# Altium project python project v2.0.PrjPcb (part 2 of 2)

## Sheet [11]-FPGA_Bank_4_Interface.SchDoc
size A3
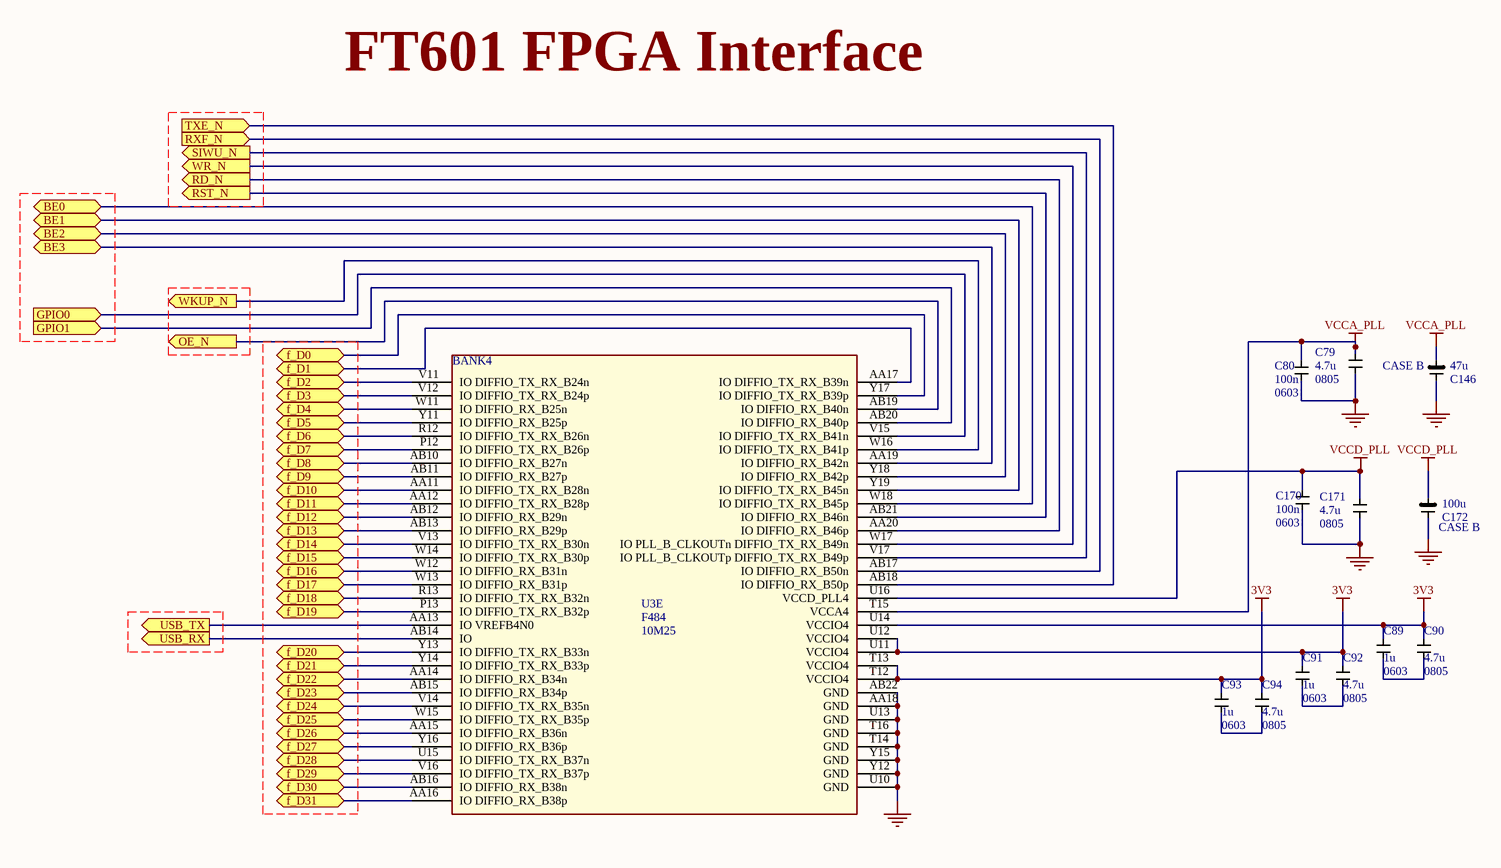
[diagram p10: [11]-FPGA_Bank_4_Interface.SchDoc]

### Parts
C79  4.7u  PCB footprint: 0805
C80  100n  PCB Layer:: 0603  [*0603]
C89  1u  PCB Layer:: 0603  [*0603]
C90  4.7u  PCB Package: 0805  [*CAPC2013X140N]
C91  1u  PCB Layer:: 0603  [*0603]
C92  4.7u  PCB Package: 0805  [*CAPC2013X140N]
C93  1u  PCB Layer:: 0603  [*0603]
C94  4.7u  PCB Package: 0805  [*CAPC2013X140N]
C146  47u  CASE: CASE B  [CAPC3529X21N]
C170  100n  PCB Layer:: 0603  [*0603]
C171  4.7u  PCB footprint: 0805
C172  100u  CASE: CASE B  [CAPC3529X21N]
U3  10M25  Package Type: F484  [*BGA484C100P22X22_2300X2300X200N]  (part E of 9)

### Ports
BE0 (bidir), BE1 (bidir), BE2 (bidir), BE3 (bidir), f_D0 (bidir), f_D1 (bidir), f_D2 (bidir), f_D3 (bidir), f_D4 (bidir), f_D5 (bidir), f_D6 (bidir), f_D7 (bidir), f_D8 (bidir), f_D9 (bidir), f_D10 (bidir), f_D11 (bidir), f_D12 (bidir), f_D13 (bidir), f_D14 (bidir), f_D15 (bidir), f_D16 (bidir), f_D17 (bidir), f_D18 (bidir), f_D19 (bidir), f_D20 (bidir), f_D21 (bidir), f_D22 (bidir), f_D23 (bidir), f_D24 (bidir), f_D25 (bidir), f_D26 (bidir), f_D27 (bidir), f_D28 (bidir), f_D29 (bidir), f_D30 (bidir), f_D31 (bidir), GPIO0 (in), GPIO1 (in), OE_N (out), RD_N (out), RST_N (out), RXF_N (in), SIWU_N (out), TXE_N (in), USB_RX (out), USB_TX (out), WKUP_N (out), WR_N (out)

### Nets
3V3: C89.2 C90.2 C91.2 C92.2 C93.2 C94.2 U3.T12(VCCIO4) U3.T13(VCCIO4) U3.U11(VCCIO4) U3.U12(VCCIO4) U3.U14(VCCIO4)
GND: C79.1 C80.1 C146.2 C170.1 C171.1 C172.2 U3.AA18(GND) U3.AB22(GND) U3.T14(GND) U3.T16(GND) U3.U10(GND) U3.U13(GND) U3.Y12(GND) U3.Y15(GND)
VCCA_PLL: C79.2 C80.2 C146.1 U3.T15(VCCA4)
VCCD_PLL: C170.2 C171.2 C172.1 U3.U16(VCCD_PLL4)
DATA_0: U3.Y17(IO_DIFFIO_TX_RX_B39p) ; port f_D0
DATA_1: U3.AA17(IO_DIFFIO_TX_RX_B39n) ; port f_D1
DATA_2: U3.V11(IO_DIFFIO_TX_RX_B24n) ; port f_D2
DATA_3: U3.V12(IO_DIFFIO_TX_RX_B24p) ; port f_D3
DATA_4: U3.W11(IO_DIFFIO_RX_B25n) ; port f_D4
DATA_5: U3.Y11(IO_DIFFIO_RX_B25p) ; port f_D5
DATA_6: U3.R12(IO_DIFFIO_TX_RX_B26n) ; port f_D6
DATA_7: U3.P12(IO_DIFFIO_TX_RX_B26p) ; port f_D7
DATA_8: U3.AB10(IO_DIFFIO_RX_B27n) ; port f_D8
DATA_9: U3.AB11(IO_DIFFIO_RX_B27p) ; port f_D9
DATA_10: U3.AA11(IO_DIFFIO_TX_RX_B28n) ; port f_D10
DATA_11: U3.AA12(IO_DIFFIO_TX_RX_B28p) ; port f_D11
DATA_12: U3.AB12(IO_DIFFIO_RX_B29n) ; port f_D12
DATA_13: U3.AB13(IO_DIFFIO_RX_B29p) ; port f_D13
DATA_14: U3.V13(IO_DIFFIO_TX_RX_B30n) ; port f_D14
DATA_15: U3.W14(IO_DIFFIO_TX_RX_B30p) ; port f_D15
DATA_16: U3.W12(IO_DIFFIO_RX_B31n) ; port f_D16
DATA_17: U3.W13(IO_DIFFIO_RX_B31p) ; port f_D17
DATA_18: U3.R13(IO_DIFFIO_TX_RX_B32n) ; port f_D18
DATA_19: U3.P13(IO_DIFFIO_TX_RX_B32p) ; port f_D19
DATA_20: U3.Y13(IO_DIFFIO_TX_RX_B33n) ; port f_D20
DATA_21: U3.Y14(IO_DIFFIO_TX_RX_B33p) ; port f_D21
DATA_22: U3.AA14(IO_DIFFIO_RX_B34n) ; port f_D22
DATA_23: U3.AB15(IO_DIFFIO_RX_B34p) ; port f_D23
DATA_24: U3.V14(IO_DIFFIO_TX_RX_B35n) ; port f_D24
DATA_25: U3.W15(IO_DIFFIO_TX_RX_B35p) ; port f_D25
DATA_26: U3.AA15(IO_DIFFIO_RX_B36n) ; port f_D26
DATA_27: U3.Y16(IO_DIFFIO_RX_B36p) ; port f_D27
DATA_28: U3.U15(IO_DIFFIO_TX_RX_B37n) ; port f_D28
DATA_29: U3.V16(IO_DIFFIO_TX_RX_B37p) ; port f_D29
DATA_30: U3.AB16(IO_DIFFIO_RX_B38n) ; port f_D30
DATA_31: U3.AA16(IO_DIFFIO_RX_B38p) ; port f_D31
NetC89_1: C89.1 C90.1
NetC91_1: C91.1 C92.1
NetC93_1: C93.1 C94.1
NetD3_1: U3.AA13(IO_VREFB4N0) ; port USB_TX
NetD4_1: U3.AB14(IO) ; port USB_RX
NetR19_1: U3.AB21(IO_DIFFIO_RX_B46n) ; port RST_N
NetR20_1: U3.W16(IO_DIFFIO_TX_RX_B41p) ; port WKUP_N
NetR21_1: U3.V15(IO_DIFFIO_TX_RX_B41n) ; port GPIO0
NetR22_1: U3.AB20(IO_DIFFIO_RX_B40p) ; port GPIO1
NetR46_1: U3.W18(IO_DIFFIO_TX_RX_B45p) ; port BE0
NetR48_1: U3.Y19(IO_DIFFIO_TX_RX_B45n) ; port BE1
NetR50_1: U3.Y18(IO_DIFFIO_RX_B42p) ; port BE2
NetR52_1: U3.AA19(IO_DIFFIO_RX_B42n) ; port BE3
NetR54_1: U3.AB18(IO_DIFFIO_RX_B50p) ; port TXE_N
NetR56_1: U3.AB17(IO_DIFFIO_RX_B50n) ; port RXF_N
NetR58_1: U3.V17(IO_PLL_B_CLKOUTp_DIFFIO_TX_RX_B49p) ; port SIWU_N
NetR59_1: U3.W17(IO_PLL_B_CLKOUTn_DIFFIO_TX_RX_B49n) ; port WR_N
NetR60_1: U3.AA20(IO_DIFFIO_RX_B46p) ; port RD_N
NetR70_1: U3.AB19(IO_DIFFIO_RX_B40n) ; port OE_N

### Notes on the sheet
- FT601 FPGA Interface
- (in symbol Component_1, part E) BANK4

### Library data of the parts
C79 C80 C89-C94 C146 C170-C172 = Component_1
  C79 C171: Buying URL:: NEED TO BE ADDED
  C80 C89 C91 C93 C170: Buying URL:: https://uk.farnell.com/avx/0603yc105kat2a/cap-1-f-16v-10-x7r-0603/dp/1658870RL?st=1u%200603
  C90 C92 C94: Buying URL:: https://uk.farnell.com/avx/08053d475kat2a/cap-4-7-f-25v-10-x5r-0805/dp/1657932?st=4.7u%200805
  C146 C172: Buying URL:: https://uk.farnell.com/avx/tajb107k006tnj/cap-tant-aec-q200-100uf-6-3v-case/dp/2893386?st=100u%20CASE%20B
U3 = Component_1: Part no.: 10M25DAF484I7G

## Sheet [12]-FPGA_Bank_5_Interface.SchDoc
size A4

## Sheet [13]-FPGA_Bank_6_Interface.SchDoc
size A3
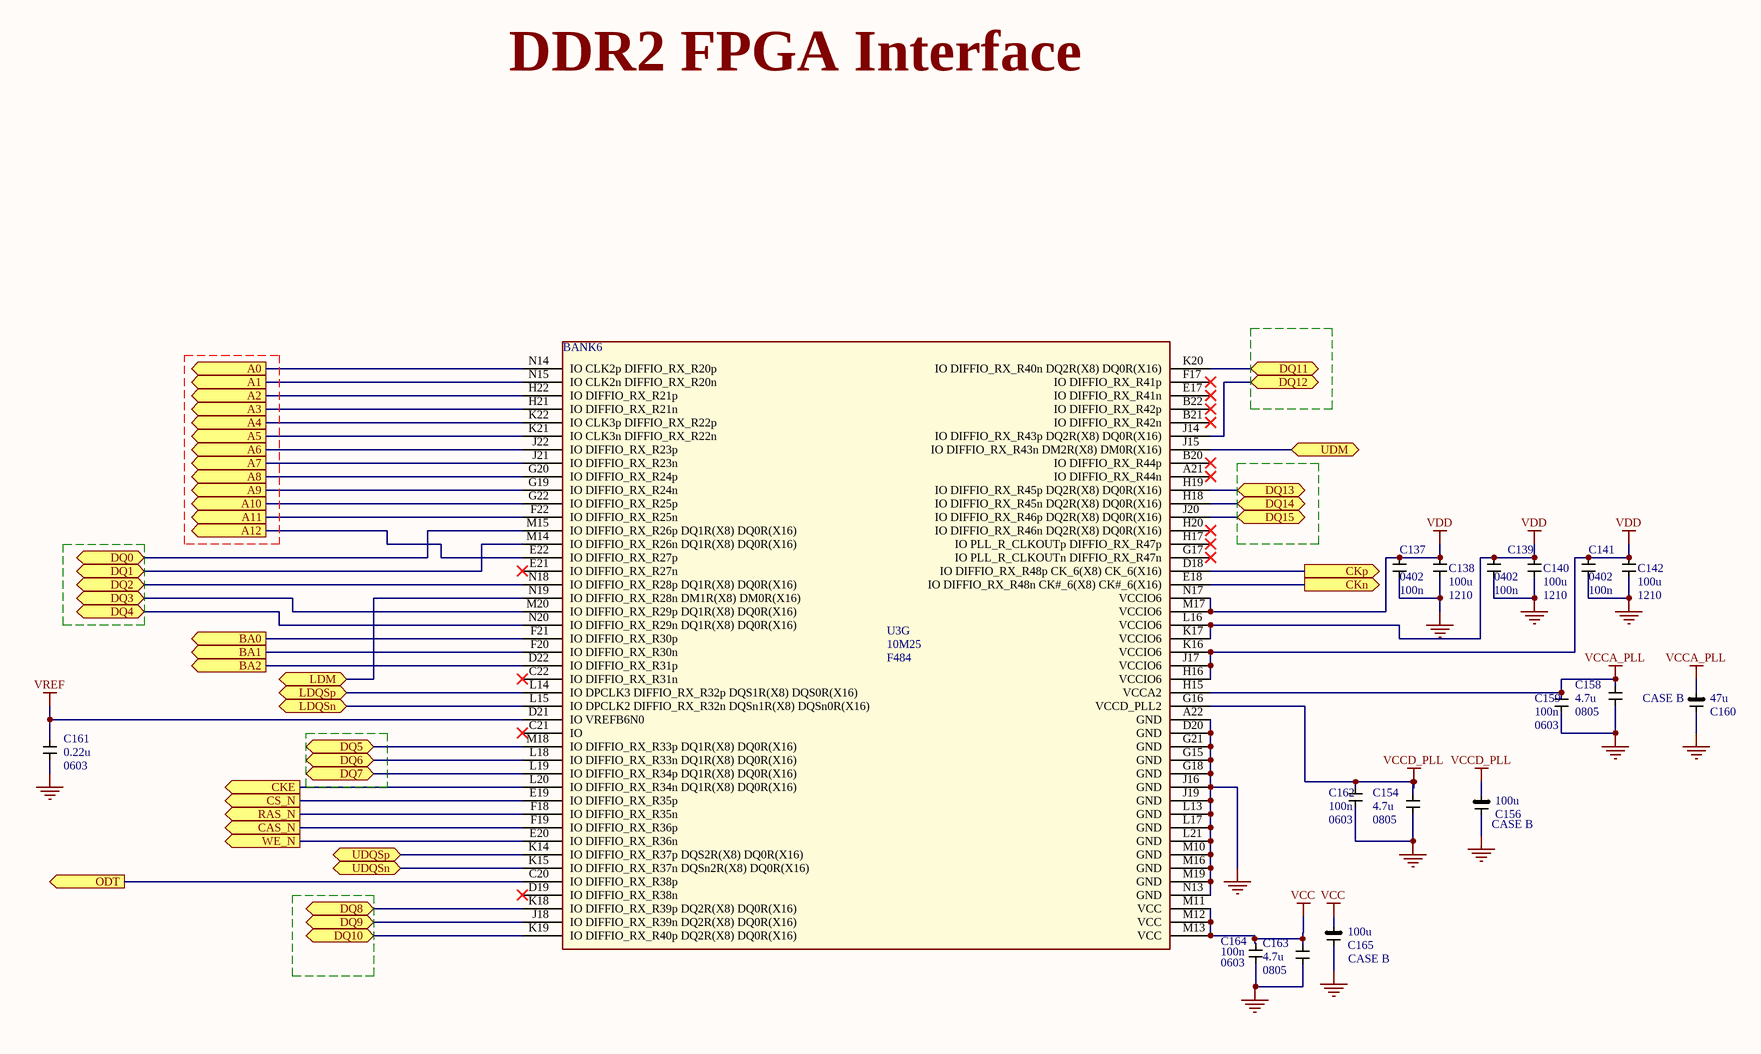
[diagram p11: [13]-FPGA_Bank_6_Interface.SchDoc]

### Parts
C137  100n
C138  100u  PCB package type: 1210  [CAPC3225X28N]
C139  100n
C140  100u  PCB package type: 1210  [CAPC3225X28N]
C141  100n
C142  100u  PCB package type: 1210  [CAPC3225X28N]
C154  4.7u  PCB footprint: 0805
C156  100u  CASE: CASE B  [CAPC3529X21N]
C158  4.7u  PCB footprint: 0805
C159  100n  PCB Layer:: 0603  [*0603]
C160  47u  CASE: CASE B  [CAPC3529X21N]
C161  0.22u  PCB Layer:: 0603  [*0603]
C162  100n  PCB Layer:: 0603  [*0603]
C163  4.7u  PCB footprint: 0805
C164  100n  PCB Layer:: 0603  [*0603]
C165  100u  CASE: CASE B  [CAPC3529X21N]
U3  10M25  Package Type: F484  [*BGA484C100P22X22_2300X2300X200N]  (part G of 9)

### Ports
A0 (out), A1 (out), A2 (out), A3 (out), A4 (out), A5 (out), A6 (out), A7 (out), A8 (out), A9 (out), A10 (out), A11 (out), A12 (out), BA0 (out), BA1 (out), BA2 (out), CAS_N (out), CKE (out), CKn (out), CKp (out), CS_N (out), DQ0, DQ1, DQ2, DQ3, DQ4, DQ5, DQ6, DQ7, DQ8, DQ9, DQ10, DQ11, DQ12, DQ13, DQ14, DQ15, LDM (bidir), LDQSn (bidir), LDQSp (bidir), ODT (out), RAS_N (out), UDM, UDQSn (bidir), UDQSp (bidir), WE_N (out)

### Nets
GND: C137.1 C138.1 C139.1 C140.1 C141.1 C142.1 C154.1 C156.2 C158.1 C159.1 C160.2 C161.1 C162.1 C163.1 C164.1 C165.2 U3.A22(GND) U3.D20(GND) U3.G15(GND) U3.G18(GND) U3.G21(GND) U3.J16(GND) U3.J19(GND) U3.L13(GND) U3.L17(GND) U3.L21(GND) U3.M10(GND) U3.M16(GND) U3.M19(GND) U3.N13(GND)
VCC: C163.2 C164.2 C165.1 U3.M11(VCC) U3.M12(VCC) U3.M13(VCC)
VCCA_PLL: C158.2 C159.2 C160.1 U3.H15(VCCA2)
VCCD_PLL: C154.2 C156.1 C162.2 U3.G16(VCCD_PLL2)
VDD: C137.2 C138.2 C139.2 C140.2 C141.2 C142.2 U3.H16(VCCIO6) U3.J17(VCCIO6) U3.K16(VCCIO6) U3.K17(VCCIO6) U3.L16(VCCIO6) U3.M17(VCCIO6) U3.N17(VCCIO6)
VREF: C161.2 U3.D21(IO_VREFB6N0)
A0: U3.N14(IO_CLK2p_DIFFIO_RX_R20p) ; port A0
A1: U3.N15(IO_CLK2n_DIFFIO_RX_R20n) ; port A1
A2: U3.H22(IO_DIFFIO_RX_R21p) ; port A2
A3: U3.H21(IO_DIFFIO_RX_R21n) ; port A3
A4: U3.K22(IO_CLK3p_DIFFIO_RX_R22p) ; port A4
A5: U3.K21(IO_CLK3n_DIFFIO_RX_R22n) ; port A5
A6: U3.J22(IO_DIFFIO_RX_R23p) ; port A6
A7: U3.J21(IO_DIFFIO_RX_R23n) ; port A7
A8: U3.G20(IO_DIFFIO_RX_R24p) ; port A8
A9: U3.G19(IO_DIFFIO_RX_R24n) ; port A9
A10: U3.G22(IO_DIFFIO_RX_R25p) ; port A10
A11: U3.F22(IO_DIFFIO_RX_R25n) ; port A11
A12: U3.E22(IO_DIFFIO_RX_R27p) ; port A12
BA0: U3.F21(IO_DIFFIO_RX_R30p) ; port BA0
BA1: U3.F20(IO_DIFFIO_RX_R30n) ; port BA1
BA2: U3.D22(IO_DIFFIO_RX_R31p) ; port BA2
CAS_N: U3.F19(IO_DIFFIO_RX_R36p) ; port CAS_N
CK_N: U3.E18(IO_DIFFIO_RX_R48n_CK#_6(X8)_CK#_6(X16)) ; port CKn
CK_P: U3.D18(IO_DIFFIO_RX_R48p_CK_6(X8)_CK_6(X16)) ; port CKp
CKE: U3.L20(IO_DIFFIO_RX_R34n_DQ1R(X8)_DQ0R(X16)) ; port CKE
CS_N: U3.E19(IO_DIFFIO_RX_R35p) ; port CS_N
DQ0: U3.M15(IO_DIFFIO_RX_R26p_DQ1R(X8)_DQ0R(X16)) ; port DQ0
DQ1: U3.M14(IO_DIFFIO_RX_R26n_DQ1R(X8)_DQ0R(X16)) ; port DQ1
DQ2: U3.N18(IO_DIFFIO_RX_R28p_DQ1R(X8)_DQ0R(X16)) ; port DQ2
DQ3: U3.M20(IO_DIFFIO_RX_R29p_DQ1R(X8)_DQ0R(X16)) ; port DQ3
DQ4: U3.N20(IO_DIFFIO_RX_R29n_DQ1R(X8)_DQ0R(X16)) ; port DQ4
DQ5: U3.M18(IO_DIFFIO_RX_R33p_DQ1R(X8)_DQ0R(X16)) ; port DQ5
DQ6: U3.L18(IO_DIFFIO_RX_R33n_DQ1R(X8)_DQ0R(X16)) ; port DQ6
DQ7: U3.L19(IO_DIFFIO_RX_R34p_DQ1R(X8)_DQ0R(X16)) ; port DQ7
DQ8: U3.K18(IO_DIFFIO_RX_R39p_DQ2R(X8)_DQ0R(X16)) ; port DQ8
DQ9: U3.J18(IO_DIFFIO_RX_R39n_DQ2R(X8)_DQ0R(X16)) ; port DQ9
DQ10: U3.K19(IO_DIFFIO_RX_R40p_DQ2R(X8)_DQ0R(X16)) ; port DQ10
DQ11: U3.K20(IO_DIFFIO_RX_R40n_DQ2R(X8)_DQ0R(X16)) ; port DQ11
DQ12: U3.J14(IO_DIFFIO_RX_R43p_DQ2R(X8)_DQ0R(X16)) ; port DQ12
DQ13: U3.H19(IO_DIFFIO_RX_R45p_DQ2R(X8)_DQ0R(X16)) ; port DQ13
DQ14: U3.H18(IO_DIFFIO_RX_R45n_DQ2R(X8)_DQ0R(X16)) ; port DQ14
DQ15: U3.J20(IO_DIFFIO_RX_R46p_DQ2R(X8)_DQ0R(X16)) ; port DQ15
LDM: U3.N19(IO_DIFFIO_RX_R28n_DM1R(X8)_DM0R(X16)) ; port LDM
LDQS_N: U3.L15(IO_DPCLK2_DIFFIO_RX_R32n_DQSn1R(X8)_DQSn0R(X16)) ; port LDQSn
LDQS_P: U3.L14(IO_DPCLK3_DIFFIO_RX_R32p_DQS1R(X8)_DQS0R(X16)) ; port LDQSp
ODT: U3.C20(IO_DIFFIO_RX_R38p) ; port ODT
RAS_N: U3.F18(IO_DIFFIO_RX_R35n) ; port RAS_N
UDM: U3.J15(IO_DIFFIO_RX_R43n_DM2R(X8)_DM0R(X16)) ; port UDM
UDQS_N: U3.K15(IO_DIFFIO_RX_R37n_DQSn2R(X8)_DQ0R(X16)) ; port UDQSn
UDQS_P: U3.K14(IO_DIFFIO_RX_R37p_DQS2R(X8)_DQ0R(X16)) ; port UDQSp
WE_N: U3.E20(IO_DIFFIO_RX_R36n) ; port WE_N

Not connected (* = marked no-connect by the designer): U3 A21(IO_DIFFIO_RX_R44n)* B20(IO_DIFFIO_RX_R44p)* B21(IO_DIFFIO_RX_R42n)* B22(IO_DIFFIO_RX_R42p)* C21(IO)* C22(IO_DIFFIO_RX_R31n)* D19(IO_DIFFIO_RX_R38n)* E17(IO_DIFFIO_RX_R41n)* E21(IO_DIFFIO_RX_R27n)* F17(IO_DIFFIO_RX_R41p)* G17(IO_PLL_R_CLKOUTn_DIFFIO_RX_R47n)* H17(IO_PLL_R_CLKOUTp_DIFFIO_RX_R47p)* H20(IO_DIFFIO_RX_R46n_DQ2R(X8)_DQ0R(X16))*

### Notes on the sheet
- DDR2 FPGA Interface
- (in symbol Component_1) 0402
- (in symbol Component_1, part G) BANK6

### Library data of the parts
C137-C142 C154 C156 C158-C165 = Component_1
  C137 C139 C141: Buying URL: https://uk.farnell.com/avx/04023c104kat2a/cap-0-1-f-25v-10-x7r-0402/dp/1867948?st=100n
  C154 C158 C163: Buying URL:: NEED TO BE ADDED
  C156 C160 C165: Buying URL:: https://uk.farnell.com/avx/tajb107k006tnj/cap-tant-aec-q200-100uf-6-3v-case/dp/2893386?st=100u%20CASE%20B
  C159 C161 C162 C164: Buying URL:: https://uk.farnell.com/avx/0603yc105kat2a/cap-1-f-16v-10-x7r-0603/dp/1658870RL?st=1u%200603
U3 = Component_1: Part no.: 10M25DAF484I7G

## Sheet [14]-FPGA_Bank_7_Interface.SchDoc
size A4
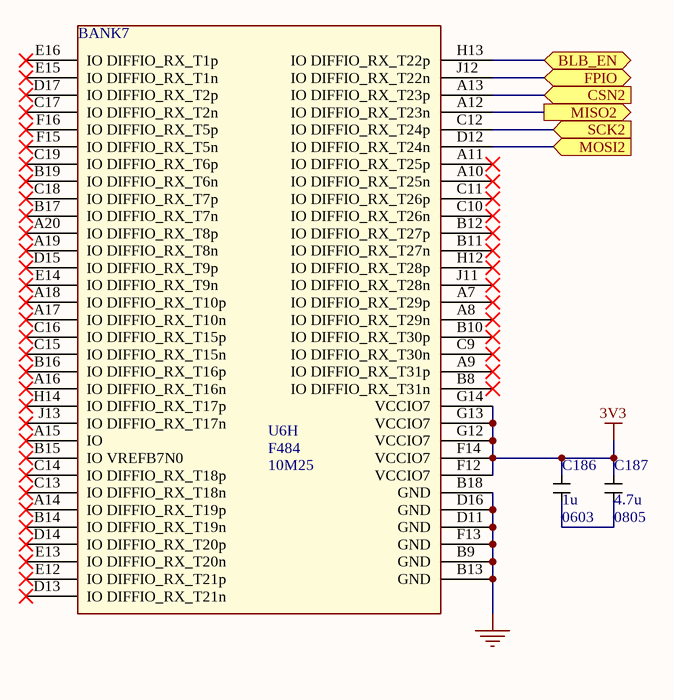
[diagram p12: [14]-FPGA_Bank_7_Interface.SchDoc]

### Parts
C186  1u  PCB Layer:: 0603  [*0603]
C187  4.7u  PCB Package: 0805  [*CAPC2013X140N]
U6  10M25  Package Type: F484  [*BGA484C100P22X22_2300X2300X200N]  (part H of 9)

### Ports
BLB_EN (bidir), CSN2 (in), FPIO (bidir), MISO2 (out), MOSI2 (in), SCK2 (in)

### Nets
3V3: C186.2 C187.2 U6.F12(VCCIO7) U6.F14(VCCIO7) U6.G12(VCCIO7) U6.G13(VCCIO7) U6.G14(VCCIO7)
GND: U6.B9(GND) U6.B13(GND) U6.B18(GND) U6.D11(GND) U6.D16(GND) U6.F13(GND)
NetC186_1: C186.1 C187.1
NetCN2_3: U6.C12(IO_DIFFIO_RX_T24p) ; port SCK2
NetCN2_4: U6.D12(IO_DIFFIO_RX_T24n) ; port MOSI2
NetCN2_5: U6.A12(IO_DIFFIO_RX_T23n) ; port MISO2
NetCN2_6: U6.A13(IO_DIFFIO_RX_T23p) ; port CSN2
NetCN2_7: U6.J12(IO_DIFFIO_RX_T22n) ; port FPIO
NetCN2_8: U6.H13(IO_DIFFIO_RX_T22p) ; port BLB_EN

Not connected (* = marked no-connect by the designer): U6 A7(IO_DIFFIO_RX_T29p)* A8(IO_DIFFIO_RX_T29n)* A9(IO_DIFFIO_RX_T31p)* A10(IO_DIFFIO_RX_T25n)* A11(IO_DIFFIO_RX_T25p)* A14(IO_DIFFIO_RX_T19p)* A15(IO)* A16(IO_DIFFIO_RX_T16n)* A17(IO_DIFFIO_RX_T10n)* A18(IO_DIFFIO_RX_T10p)* A19(IO_DIFFIO_RX_T8n)* A20(IO_DIFFIO_RX_T8p)* B8(IO_DIFFIO_RX_T31n)* B10(IO_DIFFIO_RX_T30p)* B11(IO_DIFFIO_RX_T27n)* B12(IO_DIFFIO_RX_T27p)* B14(IO_DIFFIO_RX_T19n)* B15(IO_VREFB7N0)* B16(IO_DIFFIO_RX_T16p)* B17(IO_DIFFIO_RX_T7n)* B19(IO_DIFFIO_RX_T6n)* C9(IO_DIFFIO_RX_T30n)* C10(IO_DIFFIO_RX_T26n)* C11(IO_DIFFIO_RX_T26p)* C13(IO_DIFFIO_RX_T18n)* C14(IO_DIFFIO_RX_T18p)* C15(IO_DIFFIO_RX_T15n)* C16(IO_DIFFIO_RX_T15p)* C17(IO_DIFFIO_RX_T2n)* C18(IO_DIFFIO_RX_T7p)* C19(IO_DIFFIO_RX_T6p)* D13(IO_DIFFIO_RX_T21n)* D14(IO_DIFFIO_RX_T20p)* D15(IO_DIFFIO_RX_T9p)* D17(IO_DIFFIO_RX_T2p)* E12(IO_DIFFIO_RX_T21p)* E13(IO_DIFFIO_RX_T20n)* E14(IO_DIFFIO_RX_T9n)* E15(IO_DIFFIO_RX_T1n)* E16(IO_DIFFIO_RX_T1p)* F15(IO_DIFFIO_RX_T5n)* F16(IO_DIFFIO_RX_T5p)* H12(IO_DIFFIO_RX_T28p)* H14(IO_DIFFIO_RX_T17p)* J11(IO_DIFFIO_RX_T28n)* J13(IO_DIFFIO_RX_T17n)*

### Notes on the sheet
- (in symbol Component_1, part H) BANK7

### Library data of the parts
C186 C187 = Component_1
  C186: Buying URL:: https://uk.farnell.com/avx/0603yc105kat2a/cap-1-f-16v-10-x7r-0603/dp/1658870RL?st=1u%200603
  C187: Buying URL:: https://uk.farnell.com/avx/08053d475kat2a/cap-4-7-f-25v-10-x5r-0805/dp/1657932?st=4.7u%200805
U6 = Component_1: Part no.: 10M25DAF484I7G

## Sheet [15]-FPGA_Bank_8_Interface.SchDoc
size A4
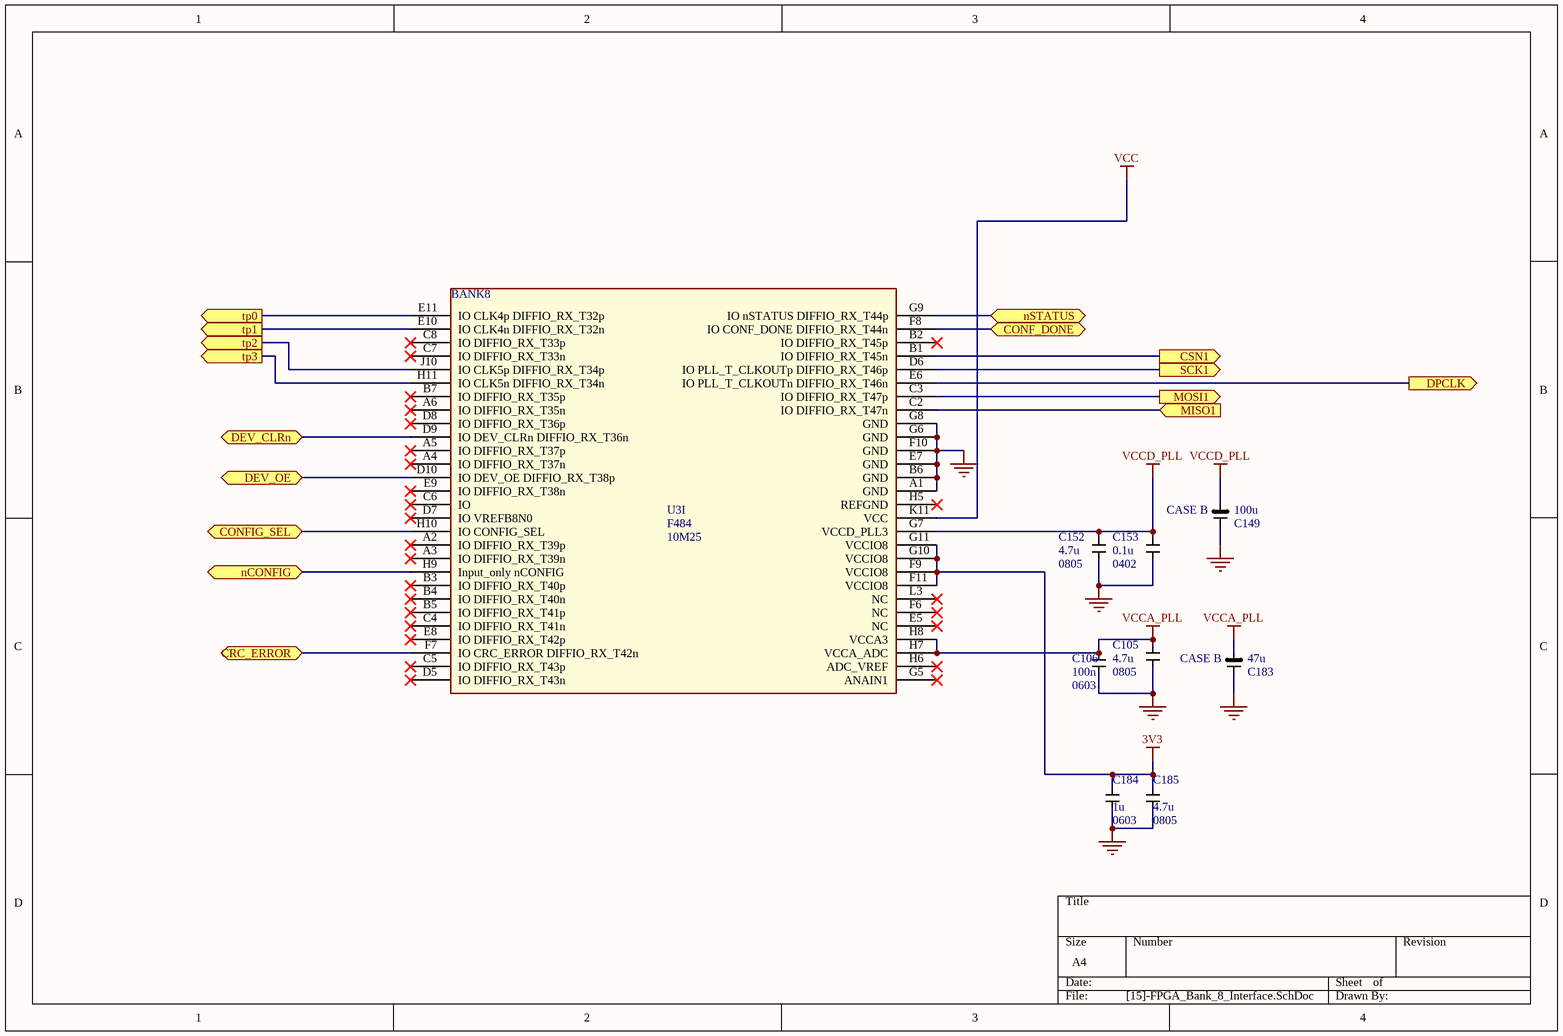
[diagram p13: [15]-FPGA_Bank_8_Interface.SchDoc]

### Parts
C105  4.7u  PCB footprint: 0805
C106  100n  PCB Layer:: 0603  [*0603]
C149  100u  CASE: CASE B  [CAPC3529X21N]
C152  4.7u  PCB footprint: 0805
C153  0.1u  PCB footprint: 0402
C183  47u  CASE: CASE B  [CAPC3529X21N]
C184  1u  PCB Layer:: 0603  [*0603]
C185  4.7u  PCB Package: 0805  [*CAPC2013X140N]
U3  10M25  Package Type: F484  [*BGA484C100P22X22_2300X2300X200N]  (part I of 9)

### Ports
CONF_DONE (bidir), CONFIG_SEL (bidir), CRC_ERROR (bidir), CSN1 (out), DEV_CLRn (bidir), DEV_OE (bidir), DPCLK (out), MISO1 (in), MOSI1 (out), nCONFIG (bidir), nSTATUS (bidir), SCK1 (out), tp0 (out), tp1 (out), tp2 (out), tp3 (out)

### Nets
3V3: C184.2 C185.2 U3.F9(VCCIO8) U3.F11(VCCIO8) U3.G10(VCCIO8) U3.G11(VCCIO8)
GND: C105.1 C106.1 C149.2 C152.1 C153.1 C183.2 C184.1 C185.1 U3.A1(GND) U3.B6(GND) U3.E7(GND) U3.F10(GND) U3.G6(GND) U3.G8(GND)
VCC: U3.K11(VCC)
VCCA_PLL: C105.2 C106.2 C183.1 U3.H7(VCCA_ADC) U3.H8(VCCA3)
VCCD_PLL: C149.1 C152.2 C153.2 U3.G7(VCCD_PLL3)
CONF_DONE: U3.F8(IO_CONF_DONE_DIFFIO_RX_T44n) ; port CONF_DONE
CONFIG_SEL: U3.H10(IO_CONFIG_SEL) ; port CONFIG_SEL
CRC_ERROR: U3.F7(IO_CRC_ERROR_DIFFIO_RX_T42n) ; port CRC_ERROR
DEV_CLRn: U3.D9(IO_DEV_CLRn_DIFFIO_RX_T36n) ; port DEV_CLRn
DEV_OE: U3.D10(IO_DEV_OE_DIFFIO_RX_T38p) ; port DEV_OE
DPCLK: U3.E6(IO_PLL_T_CLKOUTn_DIFFIO_RX_T46n) ; port DPCLK
nCONFIG: U3.H9(Input_only_nCONFIG) ; port nCONFIG
nSTATUS: U3.G9(IO_nSTATUS_DIFFIO_RX_T44p) ; port nSTATUS
NetR87_1: U3.B1(IO_DIFFIO_RX_T45n) ; port CSN1
NetR88_1: U3.C3(IO_DIFFIO_RX_T47p) ; port MOSI1
NetR89_1: U3.C2(IO_DIFFIO_RX_T47n) ; port MISO1
NetTP1_1: U3.E11(IO_CLK4p_DIFFIO_RX_T32p) ; port tp0
NetTP2_1: U3.E10(IO_CLK4n_DIFFIO_RX_T32n) ; port tp1
NetTP3_1: U3.J10(IO_CLK5p_DIFFIO_RX_T34p) ; port tp2
NetTP4_1: U3.H11(IO_CLK5n_DIFFIO_RX_T34n) ; port tp3
NetU3_D6: U3.D6(IO_PLL_T_CLKOUTp_DIFFIO_RX_T46p) ; port SCK1

Not connected (* = marked no-connect by the designer): U3 A2(IO_DIFFIO_RX_T39p)* A3(IO_DIFFIO_RX_T39n)* A4(IO_DIFFIO_RX_T37n)* A5(IO_DIFFIO_RX_T37p)* A6(IO_DIFFIO_RX_T35n)* B2(IO_DIFFIO_RX_T45p)* B3(IO_DIFFIO_RX_T40p)* B4(IO_DIFFIO_RX_T40n)* B5(IO_DIFFIO_RX_T41p)* B7(IO_DIFFIO_RX_T35p)* C4(IO_DIFFIO_RX_T41n)* C5(IO_DIFFIO_RX_T43p)* C6(IO)* C7(IO_DIFFIO_RX_T33n)* C8(IO_DIFFIO_RX_T33p)* D5(IO_DIFFIO_RX_T43n)* D7(IO_VREFB8N0)* D8(IO_DIFFIO_RX_T36p)* E5(NC)* E8(IO_DIFFIO_RX_T42p)* E9(IO_DIFFIO_RX_T38n)* F6(NC)* G5(ANAIN1)* H5(REFGND)* H6(ADC_VREF)* L3(NC)*

### Notes on the sheet
- (in symbol Component_1, part I) BANK8

### Library data of the parts
C105 C106 C149 C152 C153 C183-C185 = Component_1
  C105 C152 C153: Buying URL:: NEED TO BE ADDED
  C106 C184: Buying URL:: https://uk.farnell.com/avx/0603yc105kat2a/cap-1-f-16v-10-x7r-0603/dp/1658870RL?st=1u%200603
  C149 C183: Buying URL:: https://uk.farnell.com/avx/tajb107k006tnj/cap-tant-aec-q200-100uf-6-3v-case/dp/2893386?st=100u%20CASE%20B
  C185: Buying URL:: https://uk.farnell.com/avx/08053d475kat2a/cap-4-7-f-25v-10-x5r-0805/dp/1657932?st=4.7u%200805
U3 = Component_1: Part no.: 10M25DAF484I7G

## Sheet [16]-DDR2_Power_Supply.SchDoc
size A4
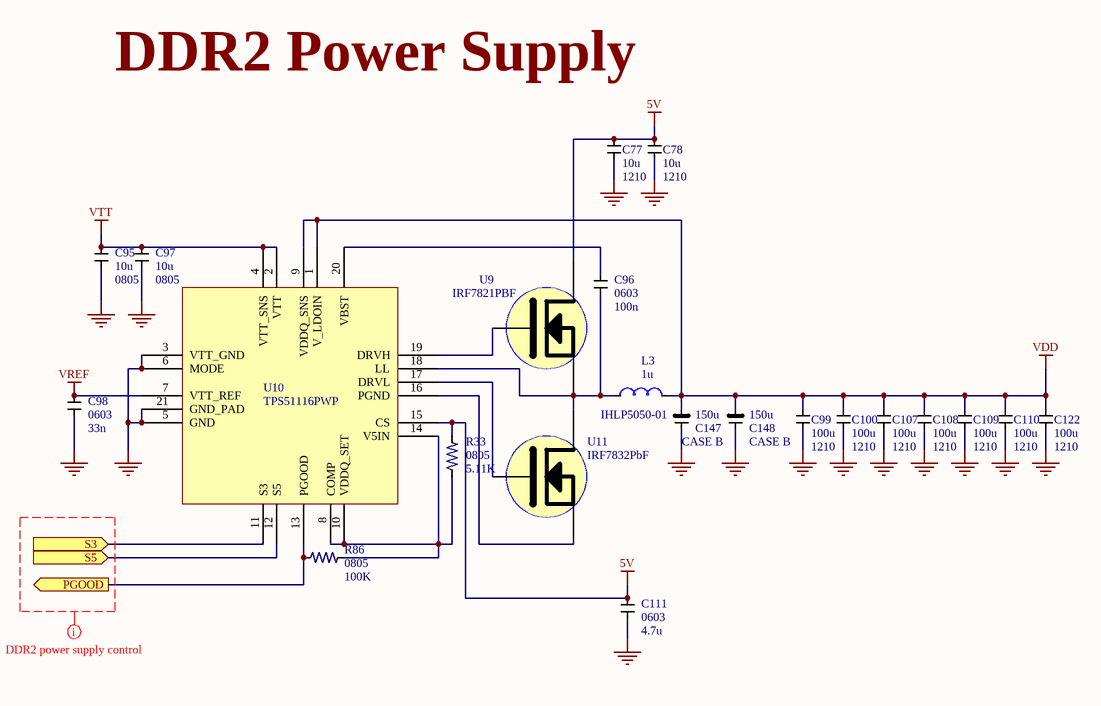
[diagram p14: [16]-DDR2_Power_Supply.SchDoc]

### Parts
C77  10u  PCB package type: 1210  [CAPC3225X28N]
C78  10u  PCB package type: 1210  [CAPC3225X28N]
C95  10u  PCB Package: 0805  [*CAPC2013X140N]
C96  100n  PCB Layer:: 0603  [*0603]
C97  10u  PCB Package: 0805  [*CAPC2013X140N]
C98  33n  PCB Layer:: 0603  [*0603]
C99  100u  PCB package type: 1210  [CAPC3225X28N]
C100  100u  PCB package type: 1210  [CAPC3225X28N]
C107  100u  PCB package type: 1210  [CAPC3225X28N]
C108  100u  PCB package type: 1210  [CAPC3225X28N]
C109  100u  PCB package type: 1210  [CAPC3225X28N]
C110  100u  PCB package type: 1210  [CAPC3225X28N]
C111  4.7u  PCB Layer:: 0603  [*0603]
C122  100u  PCB package type: 1210  [CAPC3225X28N]
C147  150u  CASE: CASE B  [CAPC3529X21N]
C148  150u  CASE: CASE B  [CAPC3529X21N]
L3  1u  [Inductor]
R33  5.11K  PCB footprint: 0805  [*RESC2012X60]
R86  100K  PCB footprint: 0805  [*RESC2012X60]
U9  IRF7821PBF  [SOIC127P600X175-8N]
U10  TPS51116PWP  [SOP65P640X120-21N]
U11  IRF7832PbF  [SOIC127P600X172-8N]

### Ports
PGOOD (out), S3 (in), S5 (in)

### Nets
5V: C77.2 C78.2 C111.2 R33.2 U9.1,2,3(S) U10.15(CS)
GND: C77.1 C78.1 C95.1 C97.1 C98.1 C99.1 C100.1 C107.1 C108.1 C109.1 C110.1 C111.1 C122.1 C147.2 C148.2 U10.3(VTT_GND) U10.5(GND) U10.6(MODE) U10.21(GND_PAD)
VDD: C99.2 C100.2 C107.2 C108.2 C109.2 C110.2 C122.2 C147.1 C148.1 L3.2 U10.1(V_LDOIN) U10.9(VDDQ_SNS)
VREF: C98.2 U10.7(VTT_REF)
VTT: C95.2 C97.2 U10.2(VTT) U10.4(VTT_SNS)
NetC96_1: C96.1 L3.1 U9.8,7,6,5(D) U10.18(LL) U11.1,2,3(S)
NetC96_2: C96.2 U10.20(VBST)
NetR33_1: R33.1 R86.2 U10.8(COMP) U10.10(VDDQ_SET) U10.14(V5IN)
NetR86_1: R86.1 U10.13(PGOOD) ; port PGOOD
NetU3_W9: U10.12(S5) ; port S5
NetU3_W10: U10.11(S3) ; port S3
NetU9_4: U9.4(G) U10.19(DRVH)
NetU10_16: U10.16(PGND) U11.8,7,6,5(D)
NetU10_17: U10.17(DRVL) U11.4(G)

### Layout directives
net class Undefined: (no net found under the mark)

### Notes on the sheet
- DDR2 Power Supply
- (in symbol Component_1) IHLP5050-01

### Library data of the parts
C77 C78 C95-C100 C107-C111 C122 C147 C148 L3 = Component_1
  C95 C97: Buying URL:: https://uk.farnell.com/avx/08053d475kat2a/cap-4-7-f-25v-10-x5r-0805/dp/1657932?st=4.7u%200805
  C96 C98 C111: Buying URL:: https://uk.farnell.com/avx/0603yc105kat2a/cap-1-f-16v-10-x7r-0603/dp/1658870RL?st=1u%200603
  C147 C148: Buying URL:: https://uk.farnell.com/panasonic-electronic-components/4tpe150mazb/cap-150-f-4v-20/dp/2354853?st=4TPC150M#
  L3: Buying URL:: https://www.mouser.co.uk/ProductDetail/Coilcraft/XFL4015-471MEC?qs=zCSbvcPd3pYzCOJSVbeMnw==
R33 R86 = RP73D1J76R8BTDG: Res Thin Film 0603 76.8 Ohm 0.1% 1/10W Â±15ppm/Â°C Molded SMD Paper T/R; Buying URL:: https://uk.farnell.com/yageo/rc0402fr-07100rl/res-100r-1-0-0625w-0402-thick/dp/9239111
U9 = Component_1: MOSFET Transistor, N Channel, 13.6 A, 30 V, 0.0091 ohm, 10 V, 1 V. Used with TPS51116.; Manufacturer: INFINEON; Designer: Faheem; Company: PhasePhotonics; Data Sheet URL: https://www.infineon.com/dgdl/irf7821pbf.pdf?fileId=5546d462533600a401535608d7f31d06; Buyer URL: https://uk.farnell.com/infineon/irf7821pbf/mosfet-n-logic-so-8/dp/1013495?ost=IRF7821PBF&ddkey=https%3Aen-GB%2FElement14_United_Kingdom%2Fsearch; Manufacturer Part No: IRF7821PBF
U10 = TPS51116PWP: DC to DC Controller Single Output Synchronous Buck 3 Volt to 28 Volt Input 20-Pin HTSSOP EP; Manufacturer: Texas Instruments; Designer: Faheem; Company: PhasePhotonics; Data Sheet: http://www.produktinfo.conrad.com/datenblaetter/1000000-1099999/001014812-da-01-en-IC_SYNC_BUCK_C_TPS51116PWPR_TSSOP_20_TID.pdf; SnapEDA_Link: https://www.snapeda.com/parts/TPS51116PWP/Texas%20Instruments/view-part/?ref=snap; Package: HTSSOP-20 Texas Instruments; Part Number: TPS51116PWP; Digi-Key_Purchase_URL: https://www.digikey.co.uk/product-detail/en/texas-instruments/TPS51116PWP/296-17243-ND/675984?utm_source=snapeda&utm_medium=aggregator&utm_campaign=symbol; Digi-Key_Part_Number: 296-17243-ND
U11 = Component_1: IRF7832TRPBF -  MOSFET Transistor, N Channel, 20 A, 30 V, 0.0031 ohm, 10 V, 2.32 V. Used with TPS51116.; Manufacturer: INFINEON; Designer: Faheem; Company: PhasePhotonics; Data Sheet URL: http://www.farnell.com/datasheets/107881.pdf?_ga=2.7827060.752270131.1548443175-886242363.1545409715&_gac=1.221262314.1547824021.Cj0KCQiAj4biBRC-ARIsAA4WaFgEVxY1DDQMjPmwclte-08yP6TbUPRUf-iJ2mTW08_wstvQJToLRRUaArGKEALw_wcB; Buyer URL: https://uk.farnell.com/infineon/irf7832trpbf/mosfet-n-ch-30v-20a-soic-8/dp/2468025?st=IRF7832; Manufacturer Part No: IRF7832TRPBF

## Sheet [17]-FPGA_Power_Supply.SchDoc
size A4
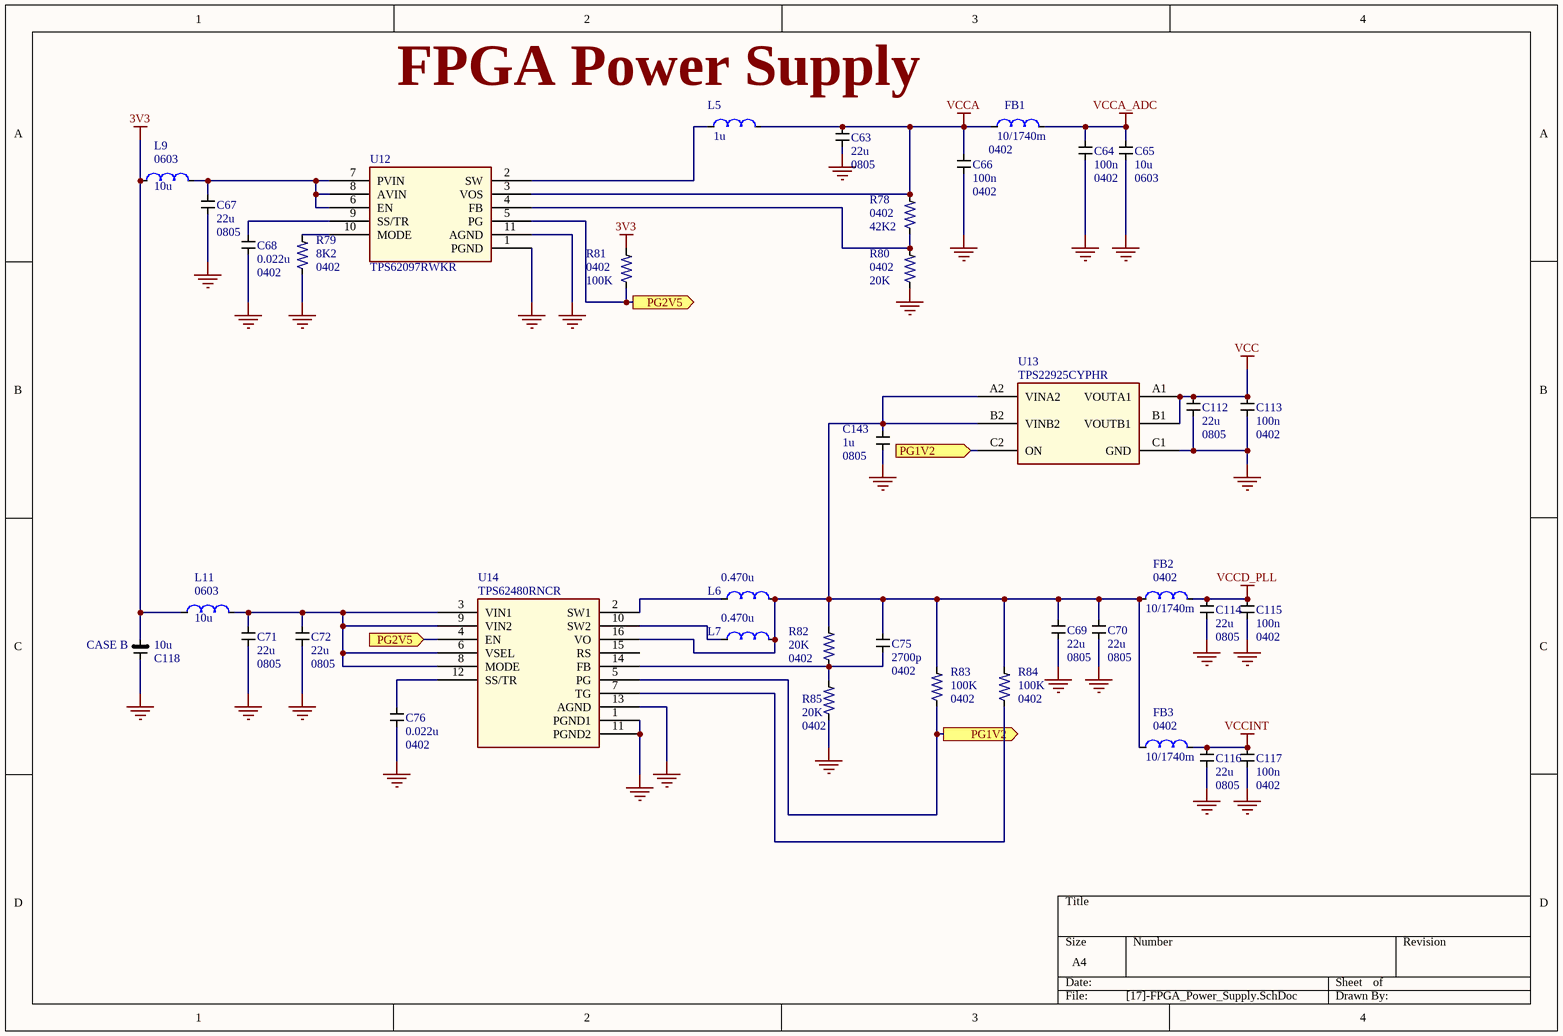
[diagram p15: [17]-FPGA_Power_Supply.SchDoc]

### Parts
C63  22u  PCB Package: 0805  [*CAPC2013X140N]
C64  100n  PCB Stake: 0402  [*CAPC1005X60N]
C65  10u  PCB footprint: 0603
C66  100n  PCB Stake: 0402  [*CAPC1005X60N]
C67  22u  PCB Package: 0805  [*CAPC2013X140N]
C68  0.022u  PCB Stake: 0402  [*CAPC1005X60N]
C69  22u  PCB Package: 0805  [*CAPC2013X140N]
C70  22u  PCB Package: 0805  [*CAPC2013X140N]
C71  22u  PCB Package: 0805  [*CAPC2013X140N]
C72  22u  PCB Package: 0805  [*CAPC2013X140N]
C75  2700p  PCB Stake: 0402  [*CAPC1005X60N]
C76  0.022u  PCB Stake: 0402  [*CAPC1005X60N]
C112  22u  PCB Package: 0805  [*CAPC2013X140N]
C113  100n  PCB Stake: 0402  [*CAPC1005X60N]
C114  22u  PCB Package: 0805  [*CAPC2013X140N]
C115  100n  PCB Stake: 0402  [*CAPC1005X60N]
C116  22u  PCB Package: 0805  [*CAPC2013X140N]
C117  100n  PCB Stake: 0402  [*CAPC1005X60N]
C118  10u  CASE: CASE B  [CAPC3529X21N]
C143  1u  PCB footprint: 0805
FB1  10/1740m  Package Type: 0402  [*CAPC1005X55N]
FB2  10/1740m  Package Type: 0402  [*CAPC1005X55N]
FB3  10/1740m  Package Type: 0402  [*CAPC1005X55N]
L5  1u  [*INDM4040X210]
L6  0.470u  [INDC3234X16N]
L7  0.470u  [INDC3234X16N]
L9  10u  PCB Layout:: 0603  [*INDC1608X95N]
L11  10u  PCB Layout:: 0603  [*INDC1608X95N]
R78  42K2  PCB footprint: 0402  [*R0402]
R79  8K2  PCB footprint: 0402  [*R0402]
R80  20K  PCB footprint: 0402  [*R0402]
R81  100K  PCB footprint: 0402  [*R0402]
R82  20K  PCB footprint: 0402  [*R0402]
R83  100K  PCB footprint: 0402  [*R0402]
R84  100K  PCB footprint: 0402  [*R0402]
R85  20K  PCB footprint: 0402  [*R0402]
U12  TPS62097RWKR  [PCBComponent_1 - duplicate1]
U13  TPS22925CYPHR  [BGA]
U14  TPS62480RNCR  [PCBComponent_1]

### Ports
PG1V2 (in), PG1V2 (out), PG2V5 (in), PG2V5 (out)

### Nets
3V3: C118.1 L9.1 L11.1 R81.2
GND: C63.1 C64.1 C65.1 C66.1 C67.1 C68.1 C69.1 C70.1 C71.1 C72.1 C76.1 C112.1 C113.1 C114.1 C115.1 C116.1 C117.1 C118.2 C143.1 R79.1 R80.1 R85.1 U12.1(PGND) U12.11(AGND) U13.C1(GND) U14.1(PGND1) U14.11(PGND2) U14.13(AGND)
VCC: C112.2 C113.2 U13.A1(VOUTA1) U13.B1(VOUTB1)
VCCA: C63.2 C66.2 FB1.1 L5.2 R78.2 U12.3(VOS)
VCCA_ADC: C64.2 C65.2 FB1.2
VCCD_PLL: C114.2 C115.2 FB2.2
VCCINT: C116.2 C117.2 FB3.2
NetC67_2: C67.2 L9.2 U12.6(EN) U12.7(PVIN) U12.8(AVIN)
NetC68_2: C68.2 U12.9(SS/TR)
NetC69_2: C69.2 C70.2 C75.2 C143.2 FB2.1 FB3.1 L6.2 L7.2 R82.2 R83.2 R84.2 U13.A2(VINA2) U13.B2(VINB2) U14.16(VO)
NetC71_2: C71.2 C72.2 L11.2 U14.3(VIN1) U14.6(VSEL) U14.8(MODE) U14.9(VIN2)
NetC75_1: C75.1 R82.1 R85.2 U14.14(FB)
NetC76_2: C76.2 U14.12(SS/TR)
NetL5_1: L5.1 U12.2(SW)
NetL6_1: L6.1 U14.2(SW1)
NetL7_1: L7.1 U14.10(SW2)
NetR78_1: R78.1 R80.2 U12.4(FB)
NetR79_2: R79.2 U12.10(MODE)
NetR81_1: R81.1 U12.5(PG) U14.4(EN) ; port PG2V5
NetR83_1: R83.1 U13.C2(ON) U14.5(PG) ; port PG1V2
NetR84_1: R84.1 U14.7(TG)

Not connected (* = marked no-connect by the designer): U14 15(RS)

### Notes on the sheet
- FPGA Power Supply

### Library data of the parts
C63-C72 C75 C76 C112-C118 C143 FB1-FB3 L5-L7 L9 L11 U12-U14 = Component_1
  C63 C67 C69-C72 C112 C114 C116: Buying URL:: https://uk.farnell.com/avx/08053d475kat2a/cap-4-7-f-25v-10-x5r-0805/dp/1657932?st=4.7u%200805
  C64 C66 C68 C75 C76 C113 C115 C117: Buying URL:: https://uk.farnell.com/avx/04023c104kat2a/cap-0-1-f-25v-10-x7r-0402/dp/1867948RL
  C65: Buying URL:: https://uk.farnell.com/avx/06031c104kat2a/cap-0-1-f-100v-10-x7r-0603/dp/2749806?st=100nf
  C118: Buying URL:: https://uk.farnell.com/avx/tajb107k006tnj/cap-tant-aec-q200-100uf-6-3v-case/dp/2893386?st=100u%20CASE%20B
  C143: Buying URL:: NEED TO BE ADDED
  FB1-FB3: Buying URL:: https://uk.farnell.com/murata/blm15ax100sn1d/ferrite-bead-0402-0-015ohm-1-74a/dp/2443220?st=BLM15AX100SN1D
  L5: Buying  URL: https://uk.farnell.com/coilcraft/xfl4020-102mec/inductor-1uh-11a-20-pwr-64mhz/dp/2289214?st=XFL4020-102ME; Package Type: 4x2x4mm
  L6 L7: Buying URL:: https://www.mouser.co.uk/ProductDetail/Coilcraft/XFL4015-471MEC?qs=zCSbvcPd3pYzCOJSVbeMnw==
  L9 L11: Buying URL:: https://uk.farnell.com/tdk/mlz1608m100wt/inductor-10uh-20-shielded/dp/2215635?st=10uH%200603
R78-R85 = RP73D1J76R8BTDG: as R33 on sheet [16]-DDR2_Power_Supply; Buying URL:: https://uk.farnell.com/yageo/rc0402fr-07100rl/res-100r-1-0-0625w-0402-thick/dp/9239111

## Nets that join several sheets
3V3: [03]-Python_Camera_Interface (8 pins), [04]-FT601_USB_Tx_Rx_Interface (18 pins), [05]-USB_C_MUX_Interface (5 pins), [07]-SDcard_Testpoints_Ext_SPI_Interface (6 pins), [08]-FPGA_Bank_1_Interface (8 pins), [10]-FPGA_Bank_3_Interface (10 pins), [11]-FPGA_Bank_4_Interface (11 pins), [14]-FPGA_Bank_7_Interface (7 pins), [15]-FPGA_Bank_8_Interface (6 pins), [17]-FPGA_Power_Supply (C118.1 L9.1 L11.1 R81.2)
5V: [04]-FT601_USB_Tx_Rx_Interface (C41.1 C44.2 VR1.3), [05]-USB_C_MUX_Interface (C81.1 L4.1), [07]-SDcard_Testpoints_Ext_SPI_Interface (C150.1 L10.2), [16]-DDR2_Power_Supply (6 pins)
GND: [03]-Python_Camera_Interface (50 pins), [04]-FT601_USB_Tx_Rx_Interface (39 pins), [05]-USB_C_MUX_Interface (30 pins), [06]-DDR2_Interface (25 pins), [07]-SDcard_Testpoints_Ext_SPI_Interface (7 pins), [08]-FPGA_Bank_1_Interface (30 pins), [10]-FPGA_Bank_3_Interface (9 pins), [11]-FPGA_Bank_4_Interface (14 pins), [13]-FPGA_Bank_6_Interface (30 pins), [14]-FPGA_Bank_7_Interface (6 pins), [15]-FPGA_Bank_8_Interface (14 pins), [16]-DDR2_Power_Supply (19 pins), [17]-FPGA_Power_Supply (28 pins)
VBUS: [04]-FT601_USB_Tx_Rx_Interface (R23.2), [05]-USB_C_MUX_Interface (7 pins)
VCC: [08]-FPGA_Bank_1_Interface (10 pins), [13]-FPGA_Bank_6_Interface (6 pins), [15]-FPGA_Bank_8_Interface (U3.K11), [17]-FPGA_Power_Supply (C112.2 C113.2 U13.A1 U13.B1)
VCCA_PLL: [11]-FPGA_Bank_4_Interface (C79.2 C80.2 C146.1 U3.T15), [13]-FPGA_Bank_6_Interface (C158.2 C159.2 C160.1 U3.H15), [15]-FPGA_Bank_8_Interface (5 pins)
VCCD_PLL: [08]-FPGA_Bank_1_Interface (C173.2 C174.2 C175.1 U3.J7), [11]-FPGA_Bank_4_Interface (C170.2 C171.2 C172.1 U3.U16), [13]-FPGA_Bank_6_Interface (C154.2 C156.1 C162.2 U3.G16), [15]-FPGA_Bank_8_Interface (C149.1 C152.2 C153.2 U3.G7), [17]-FPGA_Power_Supply (C114.2 C115.2 FB2.2)
VDD: [06]-DDR2_Interface (24 pins), [08]-FPGA_Bank_1_Interface (7 pins), [13]-FPGA_Bank_6_Interface (13 pins), [16]-DDR2_Power_Supply (12 pins)
VREF: [06]-DDR2_Interface (C135.2 U5.J2), [08]-FPGA_Bank_1_Interface (C145.2 U3.P22), [13]-FPGA_Bank_6_Interface (C161.2 U3.D21), [16]-DDR2_Power_Supply (C98.2 U10.7)
VTT: [08]-FPGA_Bank_1_Interface (C136.2 C144.2 R26.2), [16]-DDR2_Power_Supply (C95.2 C97.2 U10.2 U10.4)
A0: [06]-DDR2_Interface (U5.M8), [13]-FPGA_Bank_6_Interface (U3.N14)
A1: [06]-DDR2_Interface (U5.M3), [13]-FPGA_Bank_6_Interface (U3.N15)
A2: [06]-DDR2_Interface (U5.M7), [13]-FPGA_Bank_6_Interface (U3.H22)
A3: [06]-DDR2_Interface (U5.N2), [13]-FPGA_Bank_6_Interface (U3.H21)
A4: [06]-DDR2_Interface (U5.N8), [13]-FPGA_Bank_6_Interface (U3.K22)
A5: [06]-DDR2_Interface (U5.N3), [13]-FPGA_Bank_6_Interface (U3.K21)
A6: [06]-DDR2_Interface (U5.N7), [13]-FPGA_Bank_6_Interface (U3.J22)
A7: [06]-DDR2_Interface (U5.P2), [13]-FPGA_Bank_6_Interface (U3.J21)
A8: [06]-DDR2_Interface (U5.P8), [13]-FPGA_Bank_6_Interface (U3.G20)
A9: [06]-DDR2_Interface (U5.P3), [13]-FPGA_Bank_6_Interface (U3.G19)
A10: [06]-DDR2_Interface (U5.M2), [13]-FPGA_Bank_6_Interface (U3.G22)
A11: [06]-DDR2_Interface (U5.P7), [13]-FPGA_Bank_6_Interface (U3.F22)
A12: [06]-DDR2_Interface (U5.R2), [13]-FPGA_Bank_6_Interface (U3.E22)
BA0: [06]-DDR2_Interface (U5.L2), [13]-FPGA_Bank_6_Interface (U3.F21)
BA1: [06]-DDR2_Interface (U5.L3), [13]-FPGA_Bank_6_Interface (U3.F20)
BA2: [06]-DDR2_Interface (U5.L1), [13]-FPGA_Bank_6_Interface (U3.D22)
CAS_N: [06]-DDR2_Interface (U5.L7), [13]-FPGA_Bank_6_Interface (U3.F19)
CK_N: [06]-DDR2_Interface (U5.K8), [13]-FPGA_Bank_6_Interface (U3.E18)
CK_P: [06]-DDR2_Interface (U5.J8), [13]-FPGA_Bank_6_Interface (U3.D18)
CKE: [06]-DDR2_Interface (U5.K2), [13]-FPGA_Bank_6_Interface (U3.L20)
CLK: [04]-FT601_USB_Tx_Rx_Interface (R43.2), [10]-FPGA_Bank_3_Interface (U3.R11)
CLK_N: [03]-Python_Camera_Interface (U1.7), [10]-FPGA_Bank_3_Interface (R5.1 U3.V9)
CLK_P: [03]-Python_Camera_Interface (U1.8), [10]-FPGA_Bank_3_Interface (R5.2 U3.V10)
CLKIN_N: [03]-Python_Camera_Interface (R2.2 U1.23), [09]-FPGA_Bank_2_Interface (U3.T5)
CLKIN_P: [03]-Python_Camera_Interface (R2.1 U1.24), [09]-FPGA_Bank_2_Interface (U3.T6)
CLKPLL: [03]-Python_Camera_Interface (R4.1), [09]-FPGA_Bank_2_Interface (U3.M9)
CONF_DONE: [07]-SDcard_Testpoints_Ext_SPI_Interface (J2.4), [15]-FPGA_Bank_8_Interface (U3.F8)
CONFIG_SEL: [07]-SDcard_Testpoints_Ext_SPI_Interface (J2.8), [15]-FPGA_Bank_8_Interface (U3.H10)
CRC_ERROR: [07]-SDcard_Testpoints_Ext_SPI_Interface (J2.6), [15]-FPGA_Bank_8_Interface (U3.F7)
CS_N: [06]-DDR2_Interface (U5.L8), [13]-FPGA_Bank_6_Interface (U3.E19)
D_N: [04]-FT601_USB_Tx_Rx_Interface (U7.25), [05]-USB_C_MUX_Interface (CN1.A7 CN1.B7 D6.2)
D_P: [04]-FT601_USB_Tx_Rx_Interface (U7.23), [05]-USB_C_MUX_Interface (CN1.A6 CN1.B6 D6.1)
DATA_0: [04]-FT601_USB_Tx_Rx_Interface (R77.2), [11]-FPGA_Bank_4_Interface (U3.Y17)
DATA_1: [04]-FT601_USB_Tx_Rx_Interface (R76.2), [11]-FPGA_Bank_4_Interface (U3.AA17)
DATA_2: [04]-FT601_USB_Tx_Rx_Interface (R75.2), [11]-FPGA_Bank_4_Interface (U3.V11)
DATA_3: [04]-FT601_USB_Tx_Rx_Interface (R74.2), [11]-FPGA_Bank_4_Interface (U3.V12)
DATA_4: [04]-FT601_USB_Tx_Rx_Interface (R73.2), [11]-FPGA_Bank_4_Interface (U3.W11)
DATA_5: [04]-FT601_USB_Tx_Rx_Interface (R72.2), [11]-FPGA_Bank_4_Interface (U3.Y11)
DATA_6: [04]-FT601_USB_Tx_Rx_Interface (R71.2), [11]-FPGA_Bank_4_Interface (U3.R12)
DATA_7: [04]-FT601_USB_Tx_Rx_Interface (R61.2), [11]-FPGA_Bank_4_Interface (U3.P12)
DATA_8: [04]-FT601_USB_Tx_Rx_Interface (R57.2), [11]-FPGA_Bank_4_Interface (U3.AB10)
DATA_9: [04]-FT601_USB_Tx_Rx_Interface (R55.2), [11]-FPGA_Bank_4_Interface (U3.AB11)
DATA_10: [04]-FT601_USB_Tx_Rx_Interface (R53.2), [11]-FPGA_Bank_4_Interface (U3.AA11)
DATA_11: [04]-FT601_USB_Tx_Rx_Interface (R51.2), [11]-FPGA_Bank_4_Interface (U3.AA12)
DATA_12: [04]-FT601_USB_Tx_Rx_Interface (R49.2), [11]-FPGA_Bank_4_Interface (U3.AB12)
DATA_13: [04]-FT601_USB_Tx_Rx_Interface (R47.2), [11]-FPGA_Bank_4_Interface (U3.AB13)
DATA_14: [04]-FT601_USB_Tx_Rx_Interface (R45.2), [11]-FPGA_Bank_4_Interface (U3.V13)
DATA_15: [04]-FT601_USB_Tx_Rx_Interface (R44.2), [11]-FPGA_Bank_4_Interface (U3.W14)
DATA_16: [04]-FT601_USB_Tx_Rx_Interface (R42.2), [11]-FPGA_Bank_4_Interface (U3.W12)
DATA_17: [04]-FT601_USB_Tx_Rx_Interface (R41.2), [11]-FPGA_Bank_4_Interface (U3.W13)
DATA_18: [04]-FT601_USB_Tx_Rx_Interface (R40.2), [11]-FPGA_Bank_4_Interface (U3.R13)
DATA_19: [04]-FT601_USB_Tx_Rx_Interface (R39.2), [11]-FPGA_Bank_4_Interface (U3.P13)
DATA_20: [04]-FT601_USB_Tx_Rx_Interface (R38.2), [11]-FPGA_Bank_4_Interface (U3.Y13)
DATA_21: [04]-FT601_USB_Tx_Rx_Interface (R37.2), [11]-FPGA_Bank_4_Interface (U3.Y14)
DATA_22: [04]-FT601_USB_Tx_Rx_Interface (R36.2), [11]-FPGA_Bank_4_Interface (U3.AA14)
DATA_23: [04]-FT601_USB_Tx_Rx_Interface (R35.2), [11]-FPGA_Bank_4_Interface (U3.AB15)
DATA_24: [04]-FT601_USB_Tx_Rx_Interface (R34.2), [11]-FPGA_Bank_4_Interface (U3.V14)
DATA_25: [04]-FT601_USB_Tx_Rx_Interface (R25.2), [11]-FPGA_Bank_4_Interface (U3.W15)
DATA_26: [04]-FT601_USB_Tx_Rx_Interface (R18.2), [11]-FPGA_Bank_4_Interface (U3.AA15)
DATA_27: [04]-FT601_USB_Tx_Rx_Interface (R15.2), [11]-FPGA_Bank_4_Interface (U3.Y16)
DATA_28: [04]-FT601_USB_Tx_Rx_Interface (R14.2), [11]-FPGA_Bank_4_Interface (U3.U15)
DATA_29: [04]-FT601_USB_Tx_Rx_Interface (R13.2), [11]-FPGA_Bank_4_Interface (U3.V16)
DATA_30: [04]-FT601_USB_Tx_Rx_Interface (R12.2), [11]-FPGA_Bank_4_Interface (U3.AB16)
DATA_31: [04]-FT601_USB_Tx_Rx_Interface (R11.2), [11]-FPGA_Bank_4_Interface (U3.AA16)
DEV_CLRn: [07]-SDcard_Testpoints_Ext_SPI_Interface (J2.10), [15]-FPGA_Bank_8_Interface (U3.D9)
DEV_OE: [07]-SDcard_Testpoints_Ext_SPI_Interface (J2.7), [15]-FPGA_Bank_8_Interface (U3.D10)
DOUT0_N: [03]-Python_Camera_Interface (U1.9), [10]-FPGA_Bank_3_Interface (R6.1 U3.W6)
DOUT0_P: [03]-Python_Camera_Interface (U1.10), [10]-FPGA_Bank_3_Interface (R6.2 U3.W5)
DOUT1_N: [03]-Python_Camera_Interface (U1.11), [10]-FPGA_Bank_3_Interface (R7.2 U3.V4)
DOUT1_P: [03]-Python_Camera_Interface (U1.12), [10]-FPGA_Bank_3_Interface (R7.1 U3.V5)
DOUT2_N: [03]-Python_Camera_Interface (U1.13), [10]-FPGA_Bank_3_Interface (R8.2 U3.U6)
DOUT2_P: [03]-Python_Camera_Interface (U1.14), [10]-FPGA_Bank_3_Interface (R8.1 U3.U7)
DOUT3_N: [03]-Python_Camera_Interface (U1.15), [10]-FPGA_Bank_3_Interface (R9.2 U3.Y1)
DOUT3_P: [03]-Python_Camera_Interface (U1.16), [10]-FPGA_Bank_3_Interface (R9.1 U3.Y2)
DPCLK: [07]-SDcard_Testpoints_Ext_SPI_Interface (J2.9), [15]-FPGA_Bank_8_Interface (U3.E6)
DQ0: [06]-DDR2_Interface (U5.G8), [13]-FPGA_Bank_6_Interface (U3.M15)
DQ1: [06]-DDR2_Interface (U5.G2), [13]-FPGA_Bank_6_Interface (U3.M14)
DQ2: [06]-DDR2_Interface (U5.H7), [13]-FPGA_Bank_6_Interface (U3.N18)
DQ3: [06]-DDR2_Interface (U5.H3), [13]-FPGA_Bank_6_Interface (U3.M20)
DQ4: [06]-DDR2_Interface (U5.H1), [13]-FPGA_Bank_6_Interface (U3.N20)
DQ5: [06]-DDR2_Interface (U5.H9), [13]-FPGA_Bank_6_Interface (U3.M18)
DQ6: [06]-DDR2_Interface (U5.F1), [13]-FPGA_Bank_6_Interface (U3.L18)
DQ7: [06]-DDR2_Interface (U5.F9), [13]-FPGA_Bank_6_Interface (U3.L19)
DQ8: [06]-DDR2_Interface (U5.C8), [13]-FPGA_Bank_6_Interface (U3.K18)
DQ9: [06]-DDR2_Interface (U5.C2), [13]-FPGA_Bank_6_Interface (U3.J18)
DQ10: [06]-DDR2_Interface (U5.D7), [13]-FPGA_Bank_6_Interface (U3.K19)
DQ11: [06]-DDR2_Interface (U5.D3), [13]-FPGA_Bank_6_Interface (U3.K20)
DQ12: [06]-DDR2_Interface (U5.D1), [13]-FPGA_Bank_6_Interface (U3.J14)
DQ13: [06]-DDR2_Interface (U5.D9), [13]-FPGA_Bank_6_Interface (U3.H19)
DQ14: [06]-DDR2_Interface (U5.B1), [13]-FPGA_Bank_6_Interface (U3.H18)
DQ15: [06]-DDR2_Interface (U5.B9), [13]-FPGA_Bank_6_Interface (U3.J20)
LDM: [06]-DDR2_Interface (U5.F3), [13]-FPGA_Bank_6_Interface (U3.N19)
LDQS_N: [06]-DDR2_Interface (U5.E8), [13]-FPGA_Bank_6_Interface (U3.L15)
LDQS_P: [06]-DDR2_Interface (U5.F7), [13]-FPGA_Bank_6_Interface (U3.L14)
MISO0: [03]-Python_Camera_Interface (U1.3), [10]-FPGA_Bank_3_Interface (U3.V8)
MON0: [03]-Python_Camera_Interface (U1.44), [10]-FPGA_Bank_3_Interface (U3.AA2)
MON1: [03]-Python_Camera_Interface (U1.45), [10]-FPGA_Bank_3_Interface (U3.AA1)
MOSI0: [03]-Python_Camera_Interface (U1.2), [10]-FPGA_Bank_3_Interface (U3.Y5)
nCONFIG: [07]-SDcard_Testpoints_Ext_SPI_Interface (J2.5), [15]-FPGA_Bank_8_Interface (U3.H9)
NetCN2_3: [07]-SDcard_Testpoints_Ext_SPI_Interface (CN2.3), [14]-FPGA_Bank_7_Interface (U6.C12)
NetCN2_4: [07]-SDcard_Testpoints_Ext_SPI_Interface (CN2.4), [14]-FPGA_Bank_7_Interface (U6.D12)
NetCN2_5: [07]-SDcard_Testpoints_Ext_SPI_Interface (CN2.5), [14]-FPGA_Bank_7_Interface (U6.A12)
NetCN2_6: [07]-SDcard_Testpoints_Ext_SPI_Interface (CN2.6), [14]-FPGA_Bank_7_Interface (U6.A13)
NetCN2_7: [07]-SDcard_Testpoints_Ext_SPI_Interface (CN2.7), [14]-FPGA_Bank_7_Interface (U6.J12)
NetCN2_8: [07]-SDcard_Testpoints_Ext_SPI_Interface (CN2.8), [14]-FPGA_Bank_7_Interface (U6.H13)
NetD3_1: [04]-FT601_USB_Tx_Rx_Interface (D3.1), [11]-FPGA_Bank_4_Interface (U3.AA13)
NetD4_1: [04]-FT601_USB_Tx_Rx_Interface (D4.1), [11]-FPGA_Bank_4_Interface (U3.AB14)
NetR19_1: [04]-FT601_USB_Tx_Rx_Interface (R19.1), [11]-FPGA_Bank_4_Interface (U3.AB21)
NetR20_1: [04]-FT601_USB_Tx_Rx_Interface (R20.1), [11]-FPGA_Bank_4_Interface (U3.W16)
NetR21_1: [04]-FT601_USB_Tx_Rx_Interface (R21.1), [11]-FPGA_Bank_4_Interface (U3.V15)
NetR22_1: [04]-FT601_USB_Tx_Rx_Interface (R22.1), [11]-FPGA_Bank_4_Interface (U3.AB20)
NetR46_1: [04]-FT601_USB_Tx_Rx_Interface (R46.1), [11]-FPGA_Bank_4_Interface (U3.W18)
NetR48_1: [04]-FT601_USB_Tx_Rx_Interface (R48.1), [11]-FPGA_Bank_4_Interface (U3.Y19)
NetR50_1: [04]-FT601_USB_Tx_Rx_Interface (R50.1), [11]-FPGA_Bank_4_Interface (U3.Y18)
NetR52_1: [04]-FT601_USB_Tx_Rx_Interface (R52.1), [11]-FPGA_Bank_4_Interface (U3.AA19)
NetR54_1: [04]-FT601_USB_Tx_Rx_Interface (R54.1), [11]-FPGA_Bank_4_Interface (U3.AB18)
NetR56_1: [04]-FT601_USB_Tx_Rx_Interface (R56.1), [11]-FPGA_Bank_4_Interface (U3.AB17)
NetR58_1: [04]-FT601_USB_Tx_Rx_Interface (R58.1), [11]-FPGA_Bank_4_Interface (U3.V17)
NetR59_1: [04]-FT601_USB_Tx_Rx_Interface (R59.1), [11]-FPGA_Bank_4_Interface (U3.W17)
NetR60_1: [04]-FT601_USB_Tx_Rx_Interface (R60.1), [11]-FPGA_Bank_4_Interface (U3.AA20)
NetR62_1: [05]-USB_C_MUX_Interface (R62.1 U4.25), [09]-FPGA_Bank_2_Interface (U3.N4)
NetR63_1: [05]-USB_C_MUX_Interface (R63.1 U4.26), [09]-FPGA_Bank_2_Interface (U3.N5)
NetR64_1: [05]-USB_C_MUX_Interface (R64.1 U4.24), [09]-FPGA_Bank_2_Interface (U3.P4)
NetR65_1: [05]-USB_C_MUX_Interface (R65.1 U4.27), [09]-FPGA_Bank_2_Interface (U3.P5)
NetR66_1: [05]-USB_C_MUX_Interface (R66.1 U4.23), [09]-FPGA_Bank_2_Interface (U3.M8)
NetR70_1: [04]-FT601_USB_Tx_Rx_Interface (R70.1), [11]-FPGA_Bank_4_Interface (U3.AB19)
NetR86_1: [10]-FPGA_Bank_3_Interface (U3.AB2), [16]-DDR2_Power_Supply (R86.1 U10.13)
NetR87_1: [07]-SDcard_Testpoints_Ext_SPI_Interface (R87.1 U8.2), [15]-FPGA_Bank_8_Interface (U3.B1)
NetR88_1: [07]-SDcard_Testpoints_Ext_SPI_Interface (R88.1 U8.3), [15]-FPGA_Bank_8_Interface (U3.C3)
NetR89_1: [07]-SDcard_Testpoints_Ext_SPI_Interface (R89.1 U8.7), [15]-FPGA_Bank_8_Interface (U3.C2)
NetTP1_1: [07]-SDcard_Testpoints_Ext_SPI_Interface (TP1.1), [15]-FPGA_Bank_8_Interface (U3.E11)
NetTP2_1: [07]-SDcard_Testpoints_Ext_SPI_Interface (TP2.1), [15]-FPGA_Bank_8_Interface (U3.E10)
NetTP3_1: [07]-SDcard_Testpoints_Ext_SPI_Interface (TP3.1), [15]-FPGA_Bank_8_Interface (U3.J10)
NetTP4_1: [07]-SDcard_Testpoints_Ext_SPI_Interface (TP4.1), [15]-FPGA_Bank_8_Interface (U3.H11)
NetU3_D6: [07]-SDcard_Testpoints_Ext_SPI_Interface (U8.5), [15]-FPGA_Bank_8_Interface (U3.D6)
NetU3_W9: [10]-FPGA_Bank_3_Interface (U3.W9), [16]-DDR2_Power_Supply (U10.12)
NetU3_W10: [10]-FPGA_Bank_3_Interface (U3.W10), [16]-DDR2_Power_Supply (U10.11)
nSTATUS: [07]-SDcard_Testpoints_Ext_SPI_Interface (J2.3), [15]-FPGA_Bank_8_Interface (U3.G9)
ODT: [06]-DDR2_Interface (U5.K9), [13]-FPGA_Bank_6_Interface (U3.C20)
RAS_N: [06]-DDR2_Interface (U5.K7), [13]-FPGA_Bank_6_Interface (U3.F18)
RID_N: [04]-FT601_USB_Tx_Rx_Interface (U7.35), [05]-USB_C_MUX_Interface (D8.5 U4.10)
RID_P: [04]-FT601_USB_Tx_Rx_Interface (U7.34), [05]-USB_C_MUX_Interface (D8.4 U4.9)
RSTN: [03]-Python_Camera_Interface (U1.46), [10]-FPGA_Bank_3_Interface (U3.R9)
SCK0: [03]-Python_Camera_Interface (U1.4), [10]-FPGA_Bank_3_Interface (U3.V7)
SSN0: [03]-Python_Camera_Interface (U1.47), [10]-FPGA_Bank_3_Interface (U3.Y6)
SYNC_N: [03]-Python_Camera_Interface (U1.17), [10]-FPGA_Bank_3_Interface (R10.2 U3.W4)
SYNC_P: [03]-Python_Camera_Interface (U1.18), [10]-FPGA_Bank_3_Interface (R10.1 U3.W3)
TCK: [07]-SDcard_Testpoints_Ext_SPI_Interface (J1.1), [08]-FPGA_Bank_1_Interface (R31.2 U3.G2)
TDI: [07]-SDcard_Testpoints_Ext_SPI_Interface (J1.9), [08]-FPGA_Bank_1_Interface (R29.1 U3.L4)
TDO: [07]-SDcard_Testpoints_Ext_SPI_Interface (J1.3), [08]-FPGA_Bank_1_Interface (U3.M5)
TMS: [07]-SDcard_Testpoints_Ext_SPI_Interface (J1.5), [08]-FPGA_Bank_1_Interface (R28.1 U3.H2)
TOD_N: [04]-FT601_USB_Tx_Rx_Interface (C54.1), [05]-USB_C_MUX_Interface (D8.2 U4.7)
TOD_P: [04]-FT601_USB_Tx_Rx_Interface (C49.1), [05]-USB_C_MUX_Interface (D8.1 U4.6)
TRG0: [03]-Python_Camera_Interface (U1.41), [10]-FPGA_Bank_3_Interface (U3.P9)
TRG1: [03]-Python_Camera_Interface (U1.42), [10]-FPGA_Bank_3_Interface (U3.Y7)
TRG2: [03]-Python_Camera_Interface (U1.43), [10]-FPGA_Bank_3_Interface (U3.Y8)
UDM: [06]-DDR2_Interface (U5.B3), [13]-FPGA_Bank_6_Interface (U3.J15)
UDQS_N: [06]-DDR2_Interface (U5.A8), [13]-FPGA_Bank_6_Interface (U3.K15)
UDQS_P: [06]-DDR2_Interface (U5.B7), [13]-FPGA_Bank_6_Interface (U3.K14)
WE_N: [06]-DDR2_Interface (U5.K3), [13]-FPGA_Bank_6_Interface (U3.E20)